# EAGLE design FinalMeasurements (EAGLE 9.0.0)
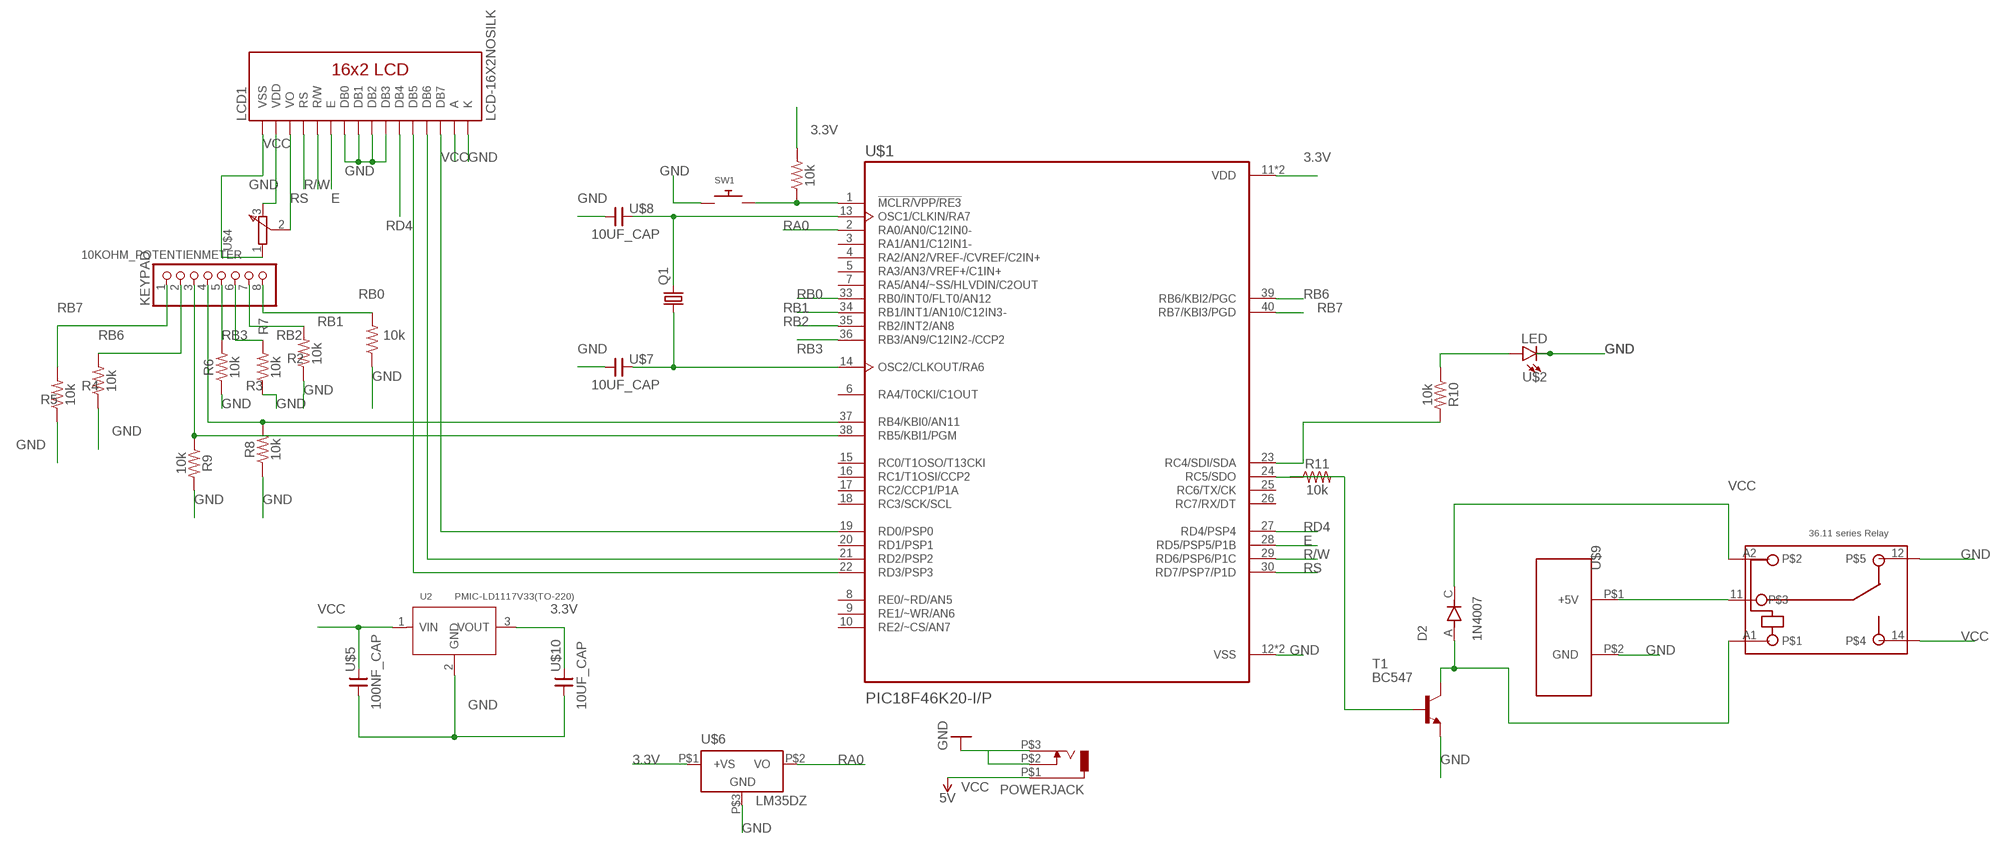
[diagram p0: schematic, sheet 1]

## Parts
D2  1N4007  [DIOAD1060W80L520D270]
K1  5V_RELAY  [RELAY_FOOTPRINT]
KEYPAD  KEYPAD_4X4MATRIXBIG  [1X08-BIG]
LCD1  LCD-16X2NOSILK  [LCD-16X2_NOSILK]
POWERJACK  DCJ0303  [DCJ0303]
Q1  CRYSTALHC49U-V  [HC49U-V]
R1  10k  10KOHM-HORIZ-1/4W-5%  [AXIAL-0.3]
R2  10k  10KOHM-HORIZ-1/4W-5%  [AXIAL-0.3]
R3  10k  10KOHM-HORIZ-1/4W-5%  [AXIAL-0.3]
R4  10k  10KOHM-HORIZ-1/4W-5%  [AXIAL-0.3]
R5  10k  10KOHM-HORIZ-1/4W-5%  [AXIAL-0.3]
R6  10k  10KOHM-HORIZ-1/4W-5%  [AXIAL-0.3]
R7  10k  10KOHM-HORIZ-1/4W-5%  [AXIAL-0.3]
R8  10k  10KOHM-HORIZ-1/4W-5%  [AXIAL-0.3]
R9  10k  10KOHM-HORIZ-1/4W-5%  [AXIAL-0.3]
R10  10k  10KOHM-HORIZ-1/4W-5%  [AXIAL-0.3]
R11  10k  10KOHM-HORIZ-1/4W-5%  [AXIAL-0.3]
SW1  SWITCH_PUSHBUTTONEVQ-PE  [TACT_PANA-EVQ]
T1  BC547  [TO92]
U2  PMIC-LD1117V33(TO-220)  [TO-220]
U$1  PIC18F46K20-I/P  [DIP1540W47P254L5320H635Q40B]
U$2  LED  [LED_3MM]
U$4  10KOHM_POTENTIENMETER  [POTENTIOMETER_FOOTPRINT]
U$5  100NF_CAP  [C025-040X018]
U$6  LM35DZ  [LM35DZ_FOOTPRINT]
U$7  10UF_CAP  [C025-040X018]
U$8  10UF_CAP  [C025-040X018]
U$9  DC_FAN  [DC_FAN_FOOTPRINT]
U$10  10UF_CAP  [C025-040X018]

## Nets
3.3V: R1.P$2 U2.3(VOUT) U$1.11(VDD) U$1.32(VDD) U$6.P$1(+VS) U$10.2
E: LCD1.6(E) U$1.28(RD5/PSP5/P1B)
GND: K1.12 LCD1.1(VSS) LCD1.7(DB0) LCD1.8(DB1) LCD1.9(DB2) LCD1.10(DB3) LCD1.16(K) POWERJACK.P$2 POWERJACK.P$3 R2.P$1 R3.P$1 R4.P$1 R5.P$1 R6.P$1 R7.P$1 R8.P$1 R9.P$2 SW1.P$1 T1.1(E) U2.2(GND) U$1.12(VSS) U$1.31(VSS) U$2.K(C) U$4.1 U$5.1 U$6.P$3(GND) U$7.1 U$8.1 U$9.P$2(GND) U$10.1
N$1: R1.P$1 SW1.P$2 U$1.1(!MCLR/VPP/RE3)
N$2: Q1.2 U$1.13(OSC1/CLKIN/RA7) U$8.2
N$3: Q1.1 U$1.14(OSC2/CLKOUT/RA6) U$7.2
N$4: R10.P$1 U$2.A
N$5: LCD1.12(DB5) U$1.22(RD3/PSP3)
N$6: LCD1.13(DB6) U$1.21(RD2/PSP2)
N$7: LCD1.14(DB7) U$1.19(RD0/PSP0)
N$8: KEYPAD.3 R9.P$1 U$1.38(RB5/KBI1/PGM)
N$9: R10.P$2 U$1.23(RC4/SDI/SDA)
N$10: LCD1.3(VO) U$4.2
N$12: KEYPAD.4 R8.P$2 U$1.37(RB4/KBI0/AN11)
N$14: D2.A K1.A1 T1.3(C)
N$15: R11.P$1 U$1.24(RC5/SDO)
N$16: K1.11 U$9.P$1(+5V)
N$17: R11.P$2 T1.2(B)
R/W: LCD1.5(R/W) U$1.29(RD6/PSP6/P1C)
RA0 [GND]: U$1.2(RA0/AN0/C12IN0-) U$6.P$2(VO)
RB0: KEYPAD.8 R7.P$2 U$1.33(RB0/INT0/FLT0/AN12)
RB1: KEYPAD.7 R2.P$2 U$1.34(RB1/INT1/AN10/C12IN3-)
RB2: KEYPAD.6 R3.P$2 U$1.35(RB2/INT2/AN8)
RB3: KEYPAD.5 R6.P$2 U$1.36(RB3/AN9/C12IN2-/CCP2)
RB6: KEYPAD.2 R4.P$2 U$1.39(RB6/KBI2/PGC)
RB7: KEYPAD.1 R5.P$2 U$1.40(RB7/KBI3/PGD)
RD4: LCD1.11(DB4) U$1.27(RD4/PSP4)
RS: LCD1.4(RS) U$1.30(RD7/PSP7/P1D)
VCC [VCC]: D2.C K1.14 K1.A2 LCD1.2(VDD) LCD1.15(A) POWERJACK.P$1 U2.1(VIN) U$4.3 U$5.2 ; supply symbol labelled 5V
Unconnected: U$1.3(RA1/AN1/C12IN1-) U$1.4(RA2/AN2/VREF-/CVREF/C2IN+) U$1.5(RA3/AN3/VREF+/C1IN+) U$1.6(RA4/T0CKI/C1OUT) U$1.7(RA5/AN4/~SS/HLVDIN/C2OUT) U$1.8(RE0/~RD/AN5) U$1.9(RE1/~WR/AN6) U$1.10(RE2/~CS/AN7) U$1.15(RC0/T1OSO/T13CKI) U$1.16(RC1/T1OSI/CCP2) U$1.17(RC2/CCP1/P1A) U$1.18(RC3/SCK/SCL) U$1.20(RD1/PSP1) U$1.25(RC6/TX/CK) U$1.26(RC7/RX/DT)

## Library data of the parts
D2 = 1N4007:1N4007: Diode Switching 1KV 1A 2-Pin DO-41 Check prices <https://pricing.snapeda.com/parts/1N4007/ON%20Semiconductor/view-part?ref=eda>; AVAILABILITY: In Stock; DESCRIPTION: Diode Standard 1000V 1A Through Hole DO-204AL (DO-41); MF: ON Semiconductor; MP: 1N4007; PACKAGE: DO-41-2 ON Semiconductor; PRICE: None
K1 = FinalCombinedComponents2:5V_RELAY: Printed circuit mount miniature 10 A relay one pole changeover contacts Conform RoHS
KEYPAD = FinalMeasurementsComponents:KEYPAD_4X4MATRIX: PIN HEADER
LCD1 = FinalMeasurementsComponents:LCD-16X2: Standard text-only 16x2 parallel input LCD Basic 16 character by 2 line display. Typically utilizes the extremely common HD44780 parallel interface chipset SparkFun Products: Basic 16x2 Green <https://www.sparkfun.com/products/255> Basic 8x2 Green <https://www.sparkfun.com/products/11122>; SF_ID: LCD-00255
POWERJACK = FinalMeasurementsComponents:DCJ0303: DC POWER JACK Source: DCJ0303.pdf
Q1 = FinalMeasurementsComponents:CRYSTAL: CRYSTAL; OC_FARNELL: 1666969; OC_NEWARK: unknown
R1 = FinalMeasurementsComponents:10KOHM: 10kΩ resistor A resistor is a passive two-terminal electrical component that implements electrical resistance as a circuit element. Resistors act to reduce current flow, and, at the same time, act to lower voltage levels within circuits. - Wikipedia; PROD_ID: RES-09435
R2-R11 = FinalCombinedComponents2:10KOHM: 10kΩ resistor A resistor is a passive two-terminal electrical component that implements electrical resistance as a circuit element. Resistors act to reduce current flow, and, at the same time, act to lower voltage levels within circuits. - Wikipedia; PROD_ID: RES-09435
SW1 = FinalMeasurementsComponents:SWITCH_PUSHBUTTON: Buttons SOFTTOUCHSMD_SJ - Soft touch temporary push button (Super Junk Akihabara) Compatible with SKPMANE010 [Mouser: 688-SKPMAN] C&K_KSS = Digikey: KSS221GLFS
T1 = BC547_TR:BC547: NPN TRANSISTOR
U2 = FinalMeasurementsComponents:PMIC-LD1117V33(TO-220): LD1117V33 "Positive Voltage Regulator 3.3V"; AVAILABILITY: Good; DESCRIPTION: Linear Voltage Regulator IC Positive Fixed 1 Output 800mA TO-220AB; MF: STMicroelectronics; MP: LD1117V33; PACKAGE: TO-220-3 ON Semiconductor; PRICE: None; PURCHASE-URL: https://pricing.snapeda.com/search/part/LD1117V33/?ref=eda
U$1 = FinalMeasurementsComponents:PIC18F46K20-I/P: Check prices <https://pricing.snapeda.com/parts/PIC18F46K20-I/P/Microchip/view-part?ref=eda>; AVAILABILITY: Bad; DESCRIPTION: PIC PIC® XLP™ 18K Microcontroller IC 8-Bit 64MHz 64KB (32K x 16) FLASH 44-TQFP (10x10); MF: Microchip; MP: PIC18F46K20-I/P; PACKAGE: PDIP-40 Microchip; PRICE: None; PURCHASE-URL: https://pricing.snapeda.com/search/part/PIC18F46K20-I/P/?ref=eda
U$2 = CombinedComponents (1):LED
U$4 = CombinedComponents:10KOHM_POTENTIENMETER
U$5 = CombinedComponents:100NF_CAP
U$6 = FinalCombinedComponents2:LM35DZ
U$7 U$8 U$10 = FinalMeasurementsComponents:10UF_CAP
U$9 = DC_Fan_Library:DC_FAN

## Net classes
1 VCC: width 0.6 mm

## Board
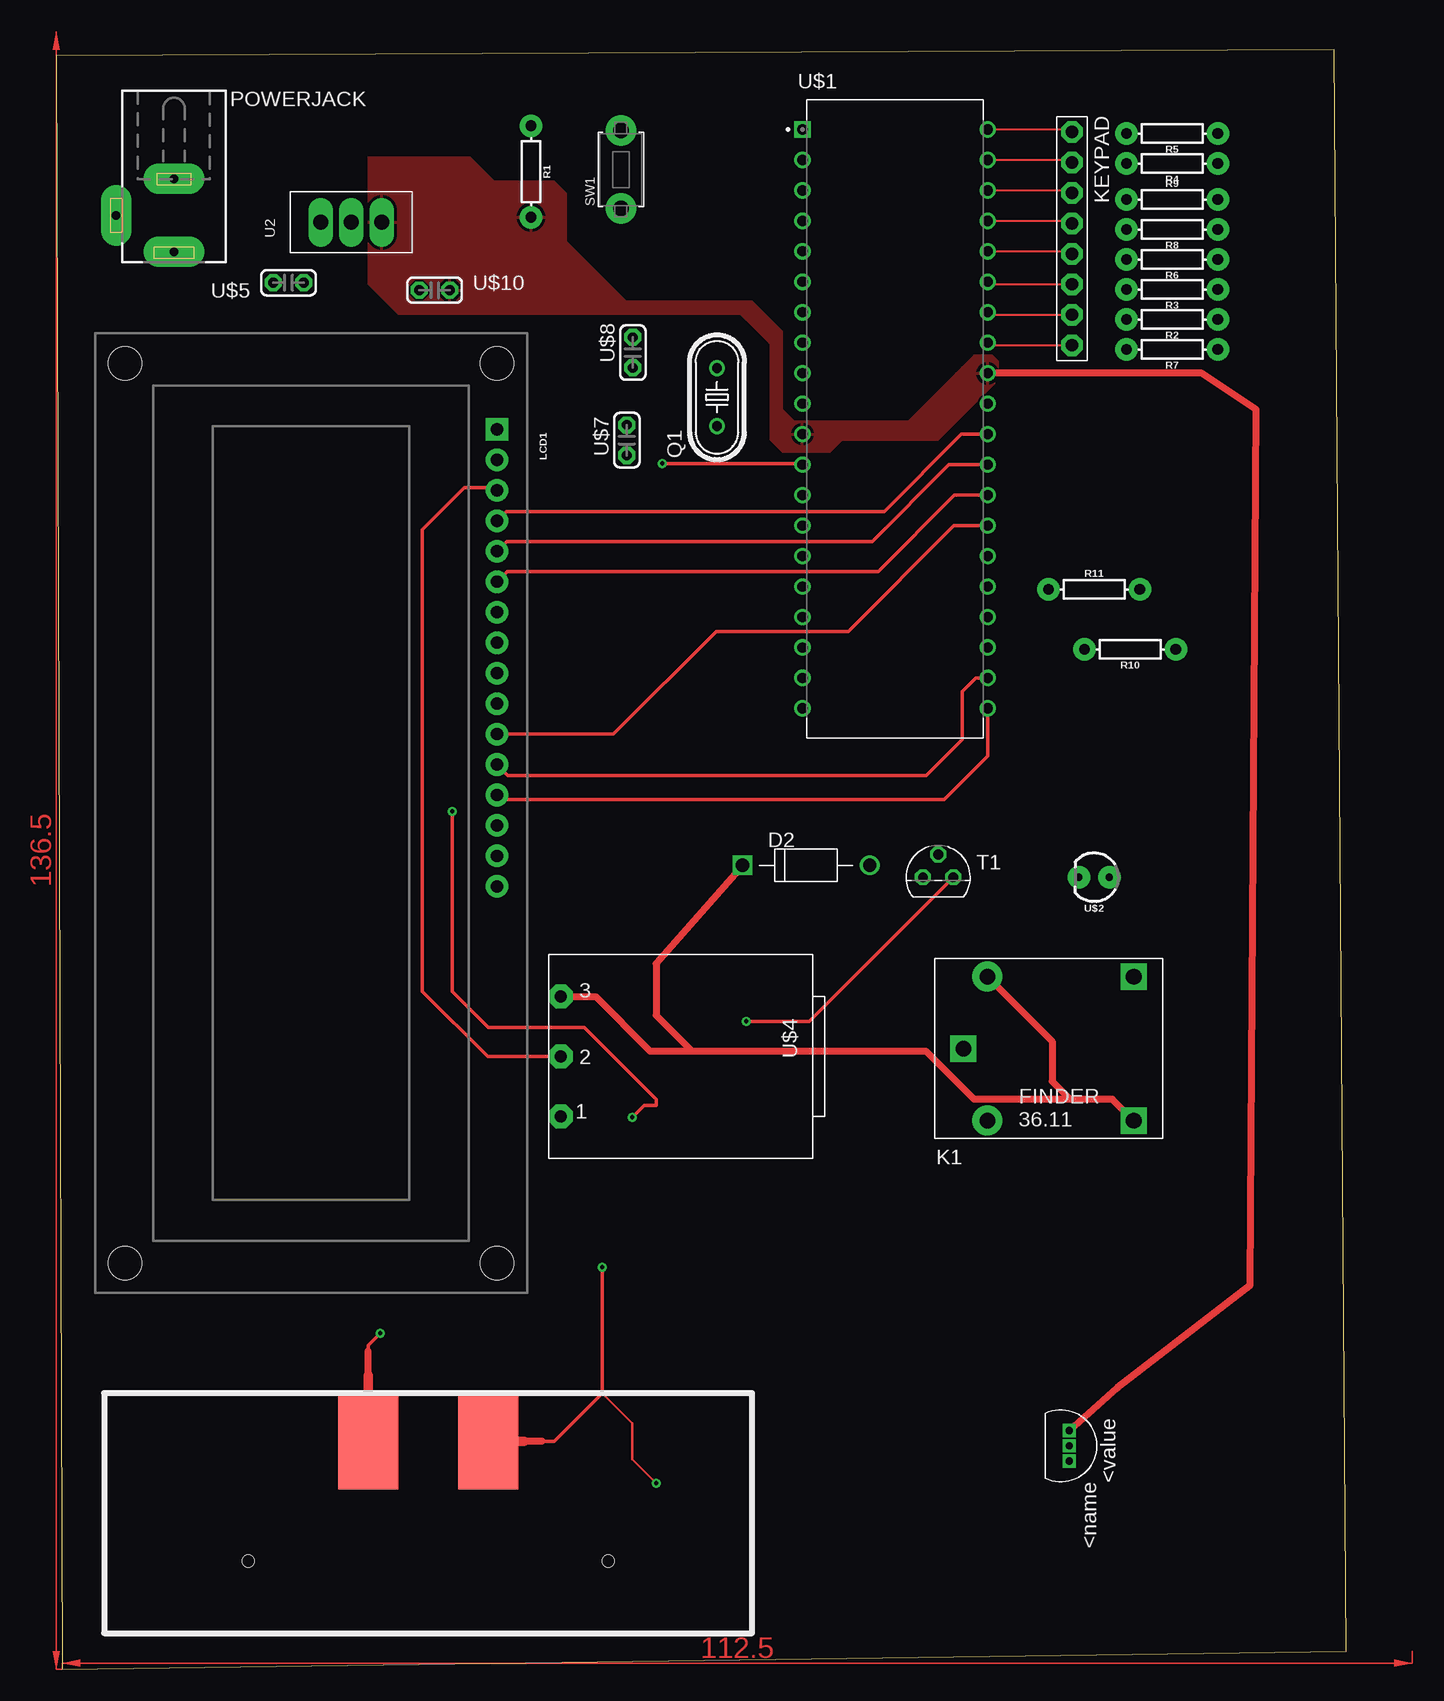
[diagram p1: board, top side]
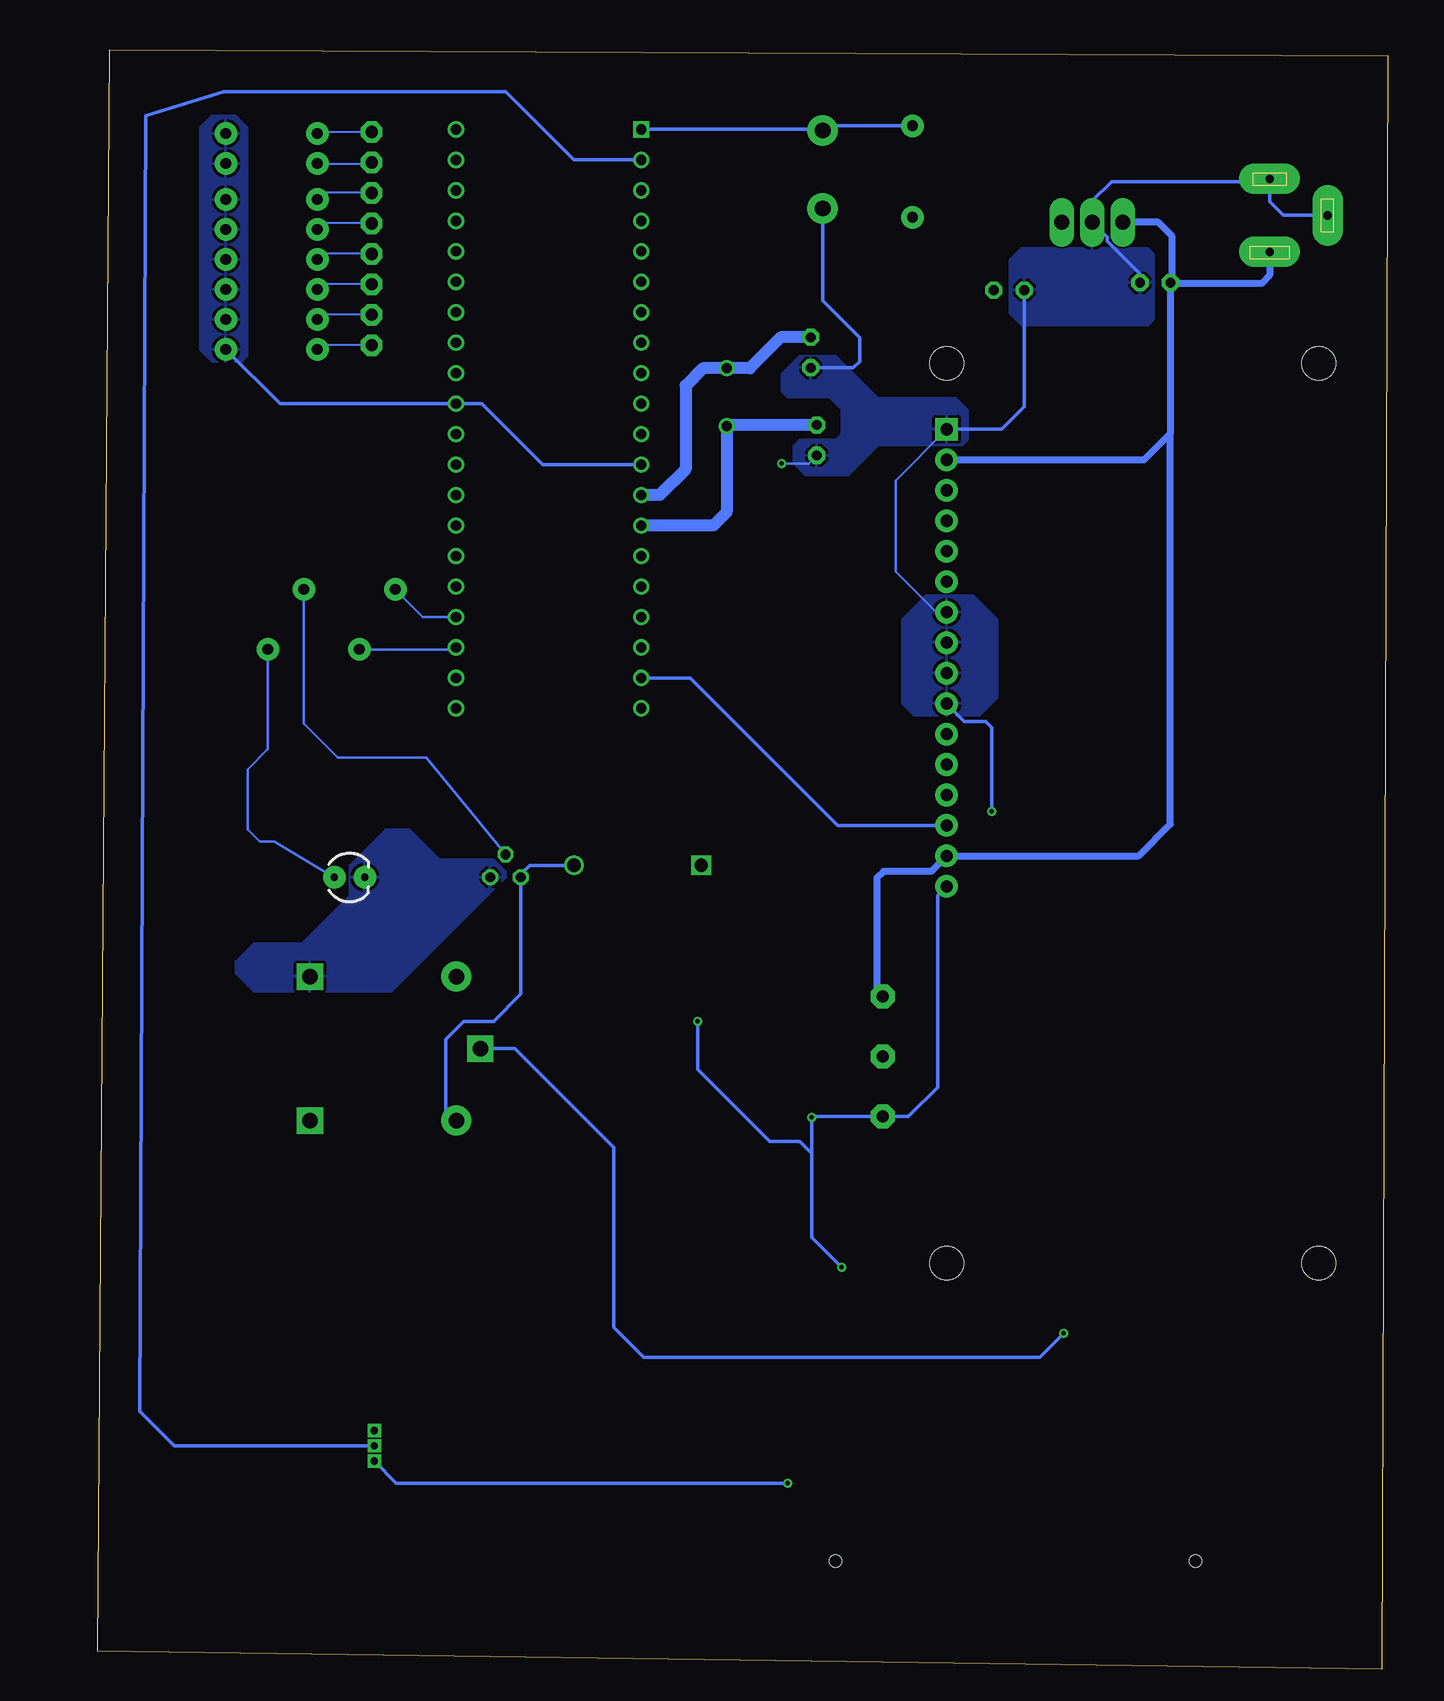
[diagram p2: board, bottom side, seen from below]

Size 107.5 x 135 mm. Coordinates in mm from the lower left corner, seen from the top.
Outline: 0.5,0 107.5,1.5 106.5,135 0,134.5 0.5,0
Copper layers (1*16): Top 0.035mm / dielectric 1.5mm / Bottom 0.035mm
Design rules "default": minimum track width 6mil, minimum drill 0.35mm, track to track 6mil, track to pad 6mil, pad to pad 6mil, via to via 6mil, smd to smd 6mil, copper to edge 40mil, drill to drill 6mil, minimum pad ring 10mil, minimum via ring 8mil, stop-mask expansion 4mil, vias tented up to drill 0mil, thermal gap 10mil

### Footprints (pad centres in the part's own frame; a part is rotated, then mirrored left to right if it is on the bottom)
DIOAD1060W80L520D270 = drill 1.1 pad 1.65: A 5.3,0 | drill 1.1 pad 1.65 square: C -5.3,0
RELAY_FOOTPRINT = drill 1.3 pad 2.184 square: 11 -7.1,0; 12 7.1,6; 14 7.1,-6 | drill 1.3 pad 2.5: A1 -5.1,-6; A2 -5.1,6
1X08-BIG = drill 1.016 pad 1.778 octagon: 1 -8.89,0; 2 -6.35,0; 3 -3.81,0; 4 -1.27,0; 5 1.27,0; 6 3.81,0; 7 6.35,0; 8 8.89,0
LCD-16X2_NOSILK = drill 1.016 pad 1.88 square: 1 -32,15.5 | drill 1.016 pad 1.88: 2 -29.46,15.5; 3 -26.92,15.5; 4 -24.38,15.5; 5 -21.84,15.5; 6 -19.3,15.5; 7 -16.76,15.5; 8 -14.22,15.5; 9 -11.68,15.5; 10 -9.14,15.5; 11 -6.6,15.5; 12 -4.06,15.5; 13 -1.52,15.5; 14 1.02,15.5; 15 3.56,15.5; 16 6.1,15.5 | hole 2.8: -37.5,15.5; -37.5,-15.5; 37.5,15.5; 37.5,-15.5
DCJ0303 = drill 0.7 pad 2.54 long: P$1 0,3.048; P$2 4.826,0; P$3 0,-3.048
HC49U-V = drill 0.813: 1 -2.413,0; 2 2.413,0
AXIAL-0.3 = drill 0.9 pad 1.88: P$1 -3.81,0; P$2 3.81,0
TACT_PANA-EVQ = drill 1.3 pad 2.54: P$1 -3.25,0; P$2 3.25,0
TO92 = drill 0.813 octagon: 1 1.27,0; 2 0,1.905; 3 -1.27,0
TO-220 = drill 1.27 pad 2.032 long: 1 -2.54,0; 2 0,0; 3 2.54,0
DIP1540W47P254L5320H635Q40B = drill 0.85 pad 1.28 square: 1 -7.718,24.13 | drill 0.85 pad 1.28: 2 -7.718,21.59; 3 -7.718,19.05; 4 -7.718,16.51; 5 -7.718,13.97; 6 -7.718,11.43; 7 -7.718,8.89; 8 -7.718,6.35; 9 -7.718,3.81; 10 -7.718,1.27; 11 -7.718,-1.27; 12 -7.718,-3.81; 13 -7.718,-6.35; 14 -7.718,-8.89; 15 -7.718,-11.43; 16 -7.718,-13.97; 17 -7.718,-16.51; 18 -7.718,-19.05; 19 -7.718,-21.59; 20 -7.718,-24.13; 21 7.718,-24.13; 22 7.718,-21.59; 23 7.718,-19.05; 24 7.718,-16.51; 25 7.718,-13.97; 26 7.718,-11.43; 27 7.718,-8.89; 28 7.718,-6.35; 29 7.718,-3.81; 30 7.718,-1.27; 31 7.718,1.27; 32 7.718,3.81; 33 7.718,6.35; 34 7.718,8.89; 35 7.718,11.43; 36 7.718,13.97; 37 7.718,16.51; 38 7.718,19.05; 39 7.718,21.59; 40 7.718,24.13
LED_3MM = drill 0.6 pad 1.88: A -1.27,0; K 1.27,0
POTENTIOMETER_FOOTPRINT = drill 1 pad 2 octagon: 1 0,5; 2 0,0; 3 0,-5
C025-040X018 = drill 0.813 pad 1.422 octagon: 1 -1.27,0; 2 1.27,0
LM35DZ_FOOTPRINT = drill 0.6 pad 1 square: P$1 -1.27,0; P$2 0,0; P$3 1.27,0
DC_FAN_FOOTPRINT = smd 5 x 8: P$1 -5,0; P$2 5,0 | hole 1: 15,-10; -15,-10

### Placement (x,y rotation side)
D2  62.5,67 0 top
K1  82.7,51.72 0 top
KEYPAD  84.66,119.24 270 top
LCD1  21.24,71.34 270 top
POWERJACK  9.82,121.18 180 top
Q1  55.07,106.02 90 top
R1  39.58,124.83 270 top
R2  93,112.5 180 top
R3  93,115 180 top
R4  93,125.5 180 top
R5  93,128 180 top
R6  93,117.5 180 top
R7  93,110 180 top
R8  93,120 180 top
R9  93,122.5 0 top
R10  89.5,85 180 top
R11  86.5,90 0 top
SW1  47.07,125 90 top
T1  73.5,66 0 top
U2  24.6,120.6 0 top
U$1  69.91,104.21 0 top
U$2  86.5,66 180 top
U$4  42.05,51.05 180 top
U$5  19.36,115.56 180 top
U$6  84.43,18.61 270 top
U$7  47.56,102.44 90 top
U$8  48.06,109.74 90 top
U$9  31,19 0 top
U$10  31.54,114.94 0 top

### Tracks (layer width: path | path; a pad name or v marks a point on that pad's centre or on a via)
3.3V
  Top 0.6: U$1.32 95.48,108.02 100,105 99.5,32 88.43,23.43 U$6.P$1
  pour Top: 26,126 26,115.5 28.5,113 57,113 59,111 59.5,110.5 59.5,102.5 60.5,101.5 63.5,101.5 64.5,101.5 65.5,102.5 73.5,102.5 78.5,107.5 78.5,109 78,109.5 77,109.5 76.5,109.5 75.5,108.5 75,108 71,104 61.5,104 60.5,105 60.5,111.5 58,114 57,114 47.5,114 47,114.5 42.5,119 42.5,123 41.5,124 36.5,124 34.5,126
E
  Top 0.3: U$1.28 74.86,97.86 68.5,91.5 37.6,91.5 LCD1.6
GND  (via drill 0.35)
  Top 0.2: 45.5,23 48,20.5 48,17.5 v50,15.5
  Top 0.3: v45.5,33.5 45.5,23 41.5,19 40.5,19 | v48,46 49,47 50,47 50,47.5 44,53.5 36,53.5 33,56.5 v33,71.5 | v50.5,100.5 62.09,100.5 U$1.12 | T1.1 62.77,54 v57.5,54
  Top 0.6: 40.5,19 39,19
  Top 0.8: 39,19 U$9.P$2
  Bottom 0.2: U$7.1 48.23,100.5 v50.5,100.5 | LCD1.1 41,99.08 41,91.5 37.6,88.1 LCD1.7
  Bottom 0.3: 48,43 v48,46 47.95,46.05 U$4.1 39.95,46.05 37.5,48.5 37.5,64.48 LCD1.16 | 48,43 48,36 v45.5,33.5 | U$1.12 70.4,100.4 75.48,105.48 U$1.31 92.29,105.48 R7.P$1 | U$10.1 30.27,105.23 32.16,103.34 LCD1.1 | SW1.P$1 47.07,114.07 44,111 44,109 44.53,108.47 U$8.1 | U$5.1 20.63,116.29 23.38,119.04 23.38,119.38 U2.2 24.6,122.4 23,124 10.05,124 POWERJACK.P$3 9.82,122.32 8.68,121.18 POWERJACK.P$2 | LCD1.10 35.26,79 33.5,79 33,78.5 v33,71.5 | v57.5,54 57.5,50 51.5,44 49,44 48,43 | U$6.P$3 82.59,15.5 v50,15.5
  pour Bottom: 19.5,118 19.5,112.5 20,112 30.5,112 31.5,113 31.5,117.5 30.5,118.5 20,118.5
  pour Bottom: 34.5,89.5 38.5,89.5 40.5,87.5 40.5,80.5 39.5,79.5 34,79.5 32.5,81 32.5,87.5
  pour Bottom: 36,106 35,105 35,102.5 35.5,102 42.5,102 43.5,101 45,99.5 48.5,99.5 49.5,100.5 49.5,102 49,102.5 48.5,102.5 46,102.5 45.5,103 45.5,105 46,105.5 46.5,106 50,106 50.5,106.5 50.5,108 49,109.5 46,109.5 42.5,106
  pour Bottom: 96,129.5 98,129.5 99,128.5 99,110 98,109 95.5,109 95,109.5 95,110 95,128.5
  pour Bottom: 93.5,56.5 83,56.5 73.5,66 73.5,66.5 74,67 74.5,67.5 79,67.5 81.5,70 83.5,70 86.5,67 86.5,64.5 90.5,60.5 94.5,60.5 96,59 96,58 95,57 94.5,56.5
N$1
  Bottom 0.152: 46.68,128.64 SW1.P$2 47.16,128.34
  Bottom 0.3: R1.P$1 46.68,128.64 | 47.16,128.34 U$1.1
N$2
  Bottom 1: U$8.2 50.56,111.01 53.14,108.43 Q1.2 57.07,108.43 58.5,107 58.5,100 60.64,97.86 U$1.13
N$3
  Bottom 0.152: 54.97,103.71 Q1.1
  Bottom 1: U$7.2 54.97,103.71 | Q1.1 55.07,96.43 56.18,95.32 U$1.14
N$4
  Bottom 0.2: R10.P$1 93.31,76.69 95,75 95,70 94,69 92.77,69 U$2.A
N$5
  Top 0.3: U$1.22 76.62,82.62 75.5,81.5 75.5,77.5 72.5,74.5 37.64,74.5 LCD1.12
N$6
  Top 0.3: U$1.21 77.63,76.13 74,72.5 37.1,72.5 LCD1.13
N$7
  Bottom 0.3: U$1.19 58.12,82.62 45.82,70.32 LCD1.14
N$8
  Top 0.152: U$1.38 84.45,123.26 KEYPAD.3
  Bottom 0.152: KEYPAD.3 88.64,123.05 R9.P$1
N$9
  Bottom 0.2: R10.P$2 77.79,85 U$1.23
N$10
  Top 0.3: U$4.2 35.95,51.05 30.5,56.5 30.5,95 34,98.5 36.5,98.5 LCD1.3
N$12
  Top 0.152: U$1.37 84.45,120.72 KEYPAD.4
  Bottom 0.152: KEYPAD.4 88.68,120.51 R8.P$2
N$14
  Bottom 0.3: K1.A1 77.88,46 78.5,46 78.5,52.5 77,54 74.5,54 72.23,56.27 T1.3 72.23,66.27 71.5,67 D2.A
N$15
  Bottom 0.2: R11.P$1 80.39,87.7 U$1.24
N$16  (via drill 0.35)
  Top 0.3: 26,26.5 26,27 v27,28
  Top 0.6: 26,24.5 26,26.5
  Top 0.8: U$9.P$1 26,24.5
  Bottom 0.3: K1.11 72.72,51.72 64.5,43.5 64.5,28.5 62,26 29,26 v27,28
N$17
  Bottom 0.2: T1.2 80.09,76 87.5,76 90.31,78.81 R11.P$2
R/W
  Top 0.3: U$1.29 74.4,100.4 68,94 37.56,94 LCD1.5
RA0
  Bottom 0.3: U$1.2 67.8,125.8 73.5,131.5 97,131.5 103.5,129.5 104,21.5 101.11,18.61 U$6.P$2
RB0
  Top 0.152: U$1.33 77.84,110.35 KEYPAD.8
  Bottom 0.152: KEYPAD.8 88.84,110.35 R7.P$2
RB1
  Top 0.152: U$1.34 77.84,112.89 KEYPAD.7
  Bottom 0.152: KEYPAD.7 88.8,112.89 R2.P$2
RB2
  Top 0.152: U$1.35 77.84,115.43 KEYPAD.6
  Bottom 0.152: KEYPAD.6 88.76,115.43 R3.P$2
RB3
  Top 0.152: U$1.36 84.45,118.18 KEYPAD.5
  Bottom 0.152: KEYPAD.5 88.72,117.97 R6.P$2
RB6
  Top 0.152: U$1.39 84.45,125.8 KEYPAD.2
  Bottom 0.152: R4.P$2 84.75,125.5 KEYPAD.2
RB7
  Top 0.152: U$1.40 84.45,128.34 KEYPAD.1
  Bottom 0.152: KEYPAD.1 89.06,128.13 R5.P$2
RD4
  Top 0.3: U$1.27 74.82,95.32 66,86.5 55,86.5 46.44,77.94 LCD1.11
RS
  Top 0.3: U$1.30 75.44,102.94 69,96.5 37.52,96.5 LCD1.4
VCC
  Top 0.6: K1.14 88.02,47.5 84.5,47.5 | 84.5,47.5 76.5,47.5 72.5,51.5 53,51.5 | 53,51.5 49.5,51.5 44.95,56.05 U$4.3 | K1.A2 83,52.32 83,49 84.5,47.5 | D2.C 50,58.8 50,54.5 53,51.5
  Bottom 0.6: U2.1 19.1,120.6 18,119.5 18,115.65 | U$4.3 42.55,56.55 42.55,65.95 42,66.5 38.02,66.5 LCD1.15 20.74,67.78 18.09,70.43 18.09,103 | LCD1.2 20.29,100.8 18.09,103 | POWERJACK.P$1 9.82,116.18 10.5,115.5 17.85,115.5 18,115.65 | 18,115.65 U$5.2 18.09,103
(copper drawn outside any net)
  shapes: Top area x2